# EAGLE design TestJig (EAGLE 6.6.0)
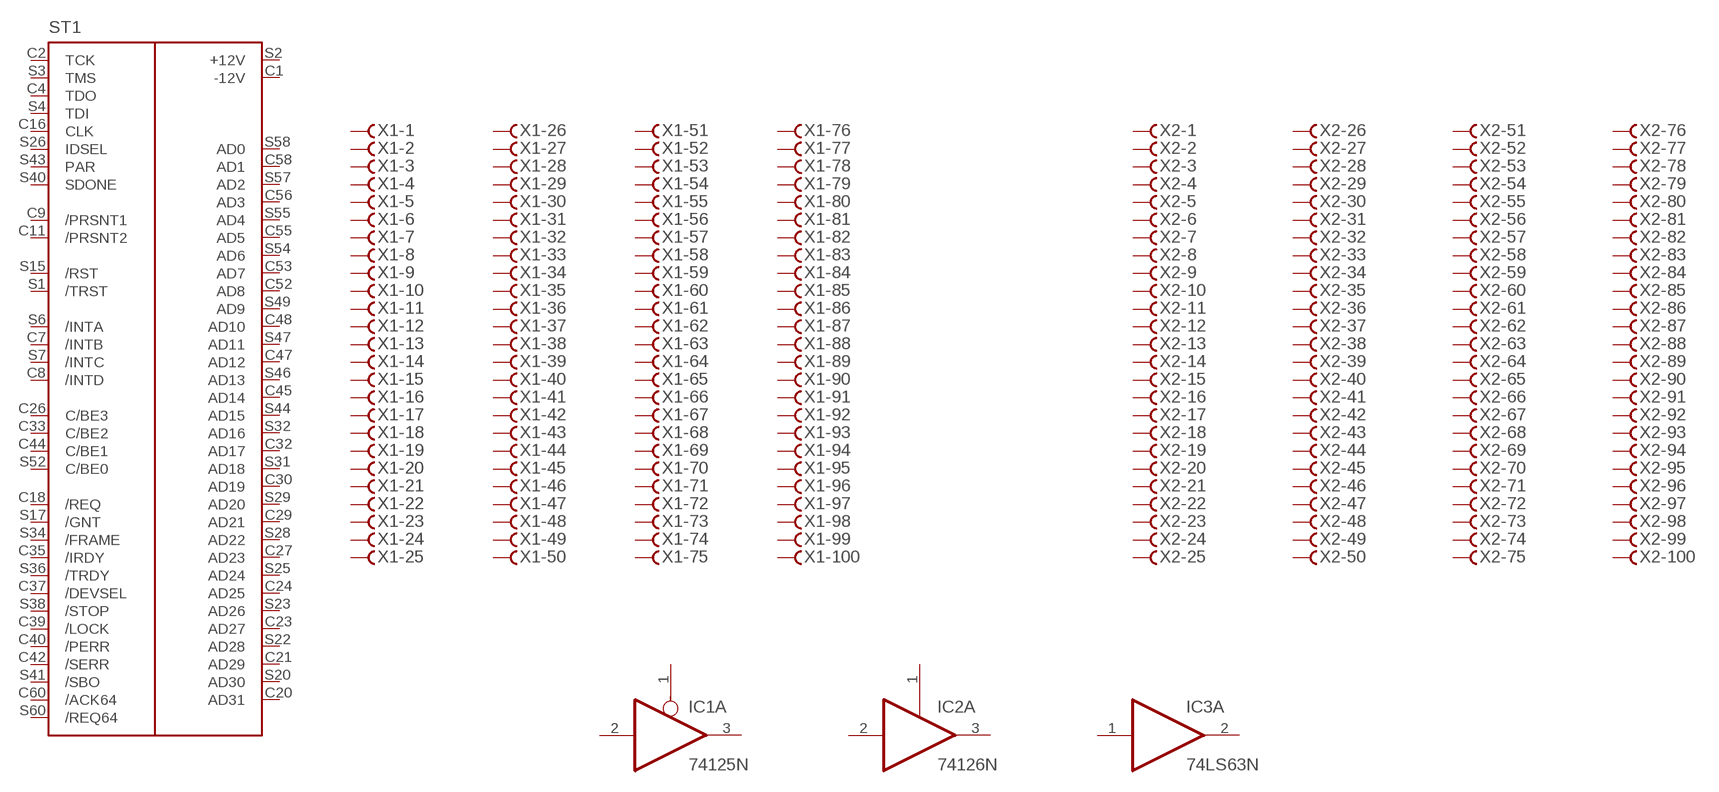
[diagram p0: schematic, sheet 1]

## Parts
IC1  74125N  [DIL14]
IC2  74126N  [DIL14]
IC3  74LS63N  [DIL14]
ST1  PCI2-SLOT  [PCI_BRD]
X1  HFR100RA  [HFR100RA]
X2  HXR100ST  [HXR100ST]
Unconnected: IC1.1(A:OE) IC1.2(A:I) IC1.3(A:O) IC1.4(B:OE) IC1.5(B:I) IC1.6(B:O) IC1.8(C:O) IC1.9(C:I) IC1.10(C:OE) IC1.11(D:O) IC1.12(D:I) IC1.13(D:OE) IC2.1(A:OE) IC2.2(A:I) IC2.3(A:O) IC2.4(B:OE) IC2.5(B:I) IC2.6(B:O) IC2.8(C:O) IC2.9(C:I) IC2.10(C:OE) IC2.11(D:O) IC2.12(D:I) IC2.13(D:OE) IC3.1(A:I) IC3.2(A:O) IC3.3(B:O) IC3.4(B:I) IC3.5(C:I) IC3.6(C:O) IC3.8(D:O) IC3.9(D:I) IC3.10(E:I) IC3.11(E:O) IC3.12(F:O) IC3.13(F:I) ST1.C2(TCK) ST1.C4(TDO) ST1.C7(/INTB) ST1.C8(/INTD) ST1.C9(/PRSNT1) ST1.C10(NC3) ST1.C11(/PRSNT2) ST1.C14(NC4) ST1.C16(CLK) ST1.C18(/REQ) ST1.C20(AD31) ST1.C21(AD29) ST1.C23(AD27) ST1.C24(AD25) ST1.C26(C/BE3) ST1.C27(AD23) ST1.C29(AD21) ST1.C30(AD19) ST1.C32(AD17) ST1.C33(C/BE2) ST1.C35(/IRDY) ST1.C37(/DEVSEL) ST1.C39(/LOCK) ST1.C40(/PERR) ST1.C42(/SERR) ST1.C44(C/BE1) ST1.C45(AD14) ST1.C47(AD12) ST1.C48(AD10) ST1.C52(AD8) ST1.C53(AD7) ST1.C55(AD5) ST1.C56(AD3) ST1.C58(AD1) ST1.C60(/ACK64) ST1.S1(/TRST) ST1.S3(TMS) ST1.S4(TDI) ST1.S6(/INTA) ST1.S7(/INTC) ST1.S9(NC0) ST1.S11(NC5) ST1.S14(NC1) ST1.S15(/RST) ST1.S17(/GNT) ST1.S19(NC2) ST1.S20(AD30) ST1.S22(AD28) ST1.S23(AD26) ST1.S25(AD24) ST1.S26(IDSEL) ST1.S28(AD22) ST1.S29(AD20) ST1.S31(AD18) ST1.S32(AD16) ST1.S34(/FRAME) ST1.S35(GND) ST1.S36(/TRDY) ST1.S38(/STOP) ST1.S39(+3,3V) ST1.S40(SDONE) ST1.S41(/SBO) ST1.S43(PAR) ST1.S44(AD15) ST1.S46(AD13) ST1.S47(AD11) ST1.S49(AD9) ST1.S52(C/BE0) ST1.S54(AD6) ST1.S55(AD4) ST1.S57(AD2) ST1.S58(AD0) ST1.S60(/REQ64) X1.1 X1.2 X1.3 X1.4 X1.5 X1.6 X1.7 X1.8 X1.9 X1.10 X1.11 X1.12 X1.13 X1.14 X1.15 X1.16 X1.17 X1.18 X1.19 X1.20 X1.21 X1.22 X1.23 X1.24 X1.25 X1.26 X1.27 X1.28 X1.29 X1.30 X1.31 X1.32 X1.33 X1.34 X1.35 X1.36 X1.37 X1.38 X1.39 X1.40 X1.41 X1.42 X1.43 X1.44 X1.45 X1.46 X1.47 X1.48 X1.49 X1.50 X1.51 X1.52 X1.53 X1.54 X1.55 X1.56 X1.57 X1.58 X1.59 X1.60 X1.61 X1.62 X1.63 X1.64 X1.65 X1.66 X1.67 X1.68 X1.69 X1.70 X1.71 X1.72 X1.73 X1.74 X1.75 X1.76 X1.77 X1.78 X1.79 X1.80 X1.81 X1.82 X1.83 X1.84 X1.85 X1.86 X1.87 X1.88 X1.89 X1.90 X1.91 X1.92 X1.93 X1.94 X1.95 X1.96 X1.97 X1.98 X1.99 X1.100 X2.1 X2.2 X2.3 X2.4 X2.5 X2.6 X2.7 X2.8 X2.9 X2.10 X2.11 X2.12 X2.13 X2.14 X2.15 X2.16 X2.17 X2.18 X2.19 X2.20 X2.21 X2.22 X2.23 X2.24 X2.25 X2.26 X2.27 X2.28 X2.29 X2.30 X2.31 X2.32 X2.33 X2.34 X2.35 X2.36 X2.37 X2.38 X2.39 X2.40 X2.41 X2.42 X2.43 X2.44 X2.45 X2.46 X2.47 X2.48 X2.49 X2.50 X2.51 X2.52 X2.53 X2.54 X2.55 X2.56 X2.57 X2.58 X2.59 X2.60 X2.61 X2.62 X2.63 X2.64 X2.65 X2.66 X2.67 X2.68 X2.69 X2.70 X2.71 X2.72 X2.73 X2.74 X2.75 X2.76 X2.77 X2.78 X2.79 X2.80 X2.81 X2.82 X2.83 X2.84 X2.85 X2.86 X2.87 X2.88 X2.89 X2.90 X2.91 X2.92 X2.93 X2.94 X2.95 X2.96 X2.97 X2.98 X2.99 X2.100

## Power pins joined to a net without a drawn wire
+3,3V: ST1.C25(+3,3V) ST1.C31(+3,3V) ST1.C36(+3,3V) ST1.C41(+3,3V) ST1.C43(+3,3V) ST1.C54(+3,3V) ST1.S21(+3,3V) ST1.S27(+3,3V) ST1.S33(+3,3V) ST1.S45(+3,3V) ST1.S53(+3,3V)
+5V: ST1.C5(+5V) ST1.C6(+5V) ST1.C19(+5V) ST1.C59(+5V) ST1.C61(+5V) ST1.C62(+5V) ST1.S5(+5V) ST1.S8(+5V) ST1.S10(+5V) ST1.S16(+5V) ST1.S59(+5V) ST1.S61(+5V) ST1.S62(+5V)
+12V: ST1.S2(+12V)
-12V: ST1.C1(-12V)
GND: IC1.7(P:GND) IC2.7(P:GND) IC3.7(P:GND) ST1.C3(GND) ST1.C12(GND) ST1.C13(GND) ST1.C15(GND) ST1.C17(GND) ST1.C22(GND) ST1.C28(GND) ST1.C34(GND) ST1.C38(GND) ST1.C46(GND) ST1.C49(GND) ST1.C57(GND) ST1.S12(GND) ST1.S13(GND) ST1.S18(GND) ST1.S24(GND) ST1.S30(GND) ST1.S37(GND) ST1.S42(GND) ST1.S48(GND) ST1.S56(GND)
VCC: IC1.14(P:VCC) IC2.14(P:VCC) IC3.14(P:VCC)

## Library data of the parts
IC1 = 74xx-us:74*125: Quad bus BUFFER, 3-state
IC2 = 74xx-us:74*126: Quad bus BUFFER, 3-state
IC3 = 74xx-us:74*63: Hex current sensing INTERFACE gate, totem pole
ST1 = con-pc:PCI2-SLOT: PCI BOARD SHORT
X1 = con-thomas-betts:HFR100RA: THOMAS&BETTS; MPN: HFR100RA29CX1; OC_FARNELL: unknown; OC_NEWARK: 92F1766
X2 = con-thomas-betts:HXR100ST: THOMAS&BETTS; OC_FARNELL: unknown; OC_NEWARK: unknown

## Board
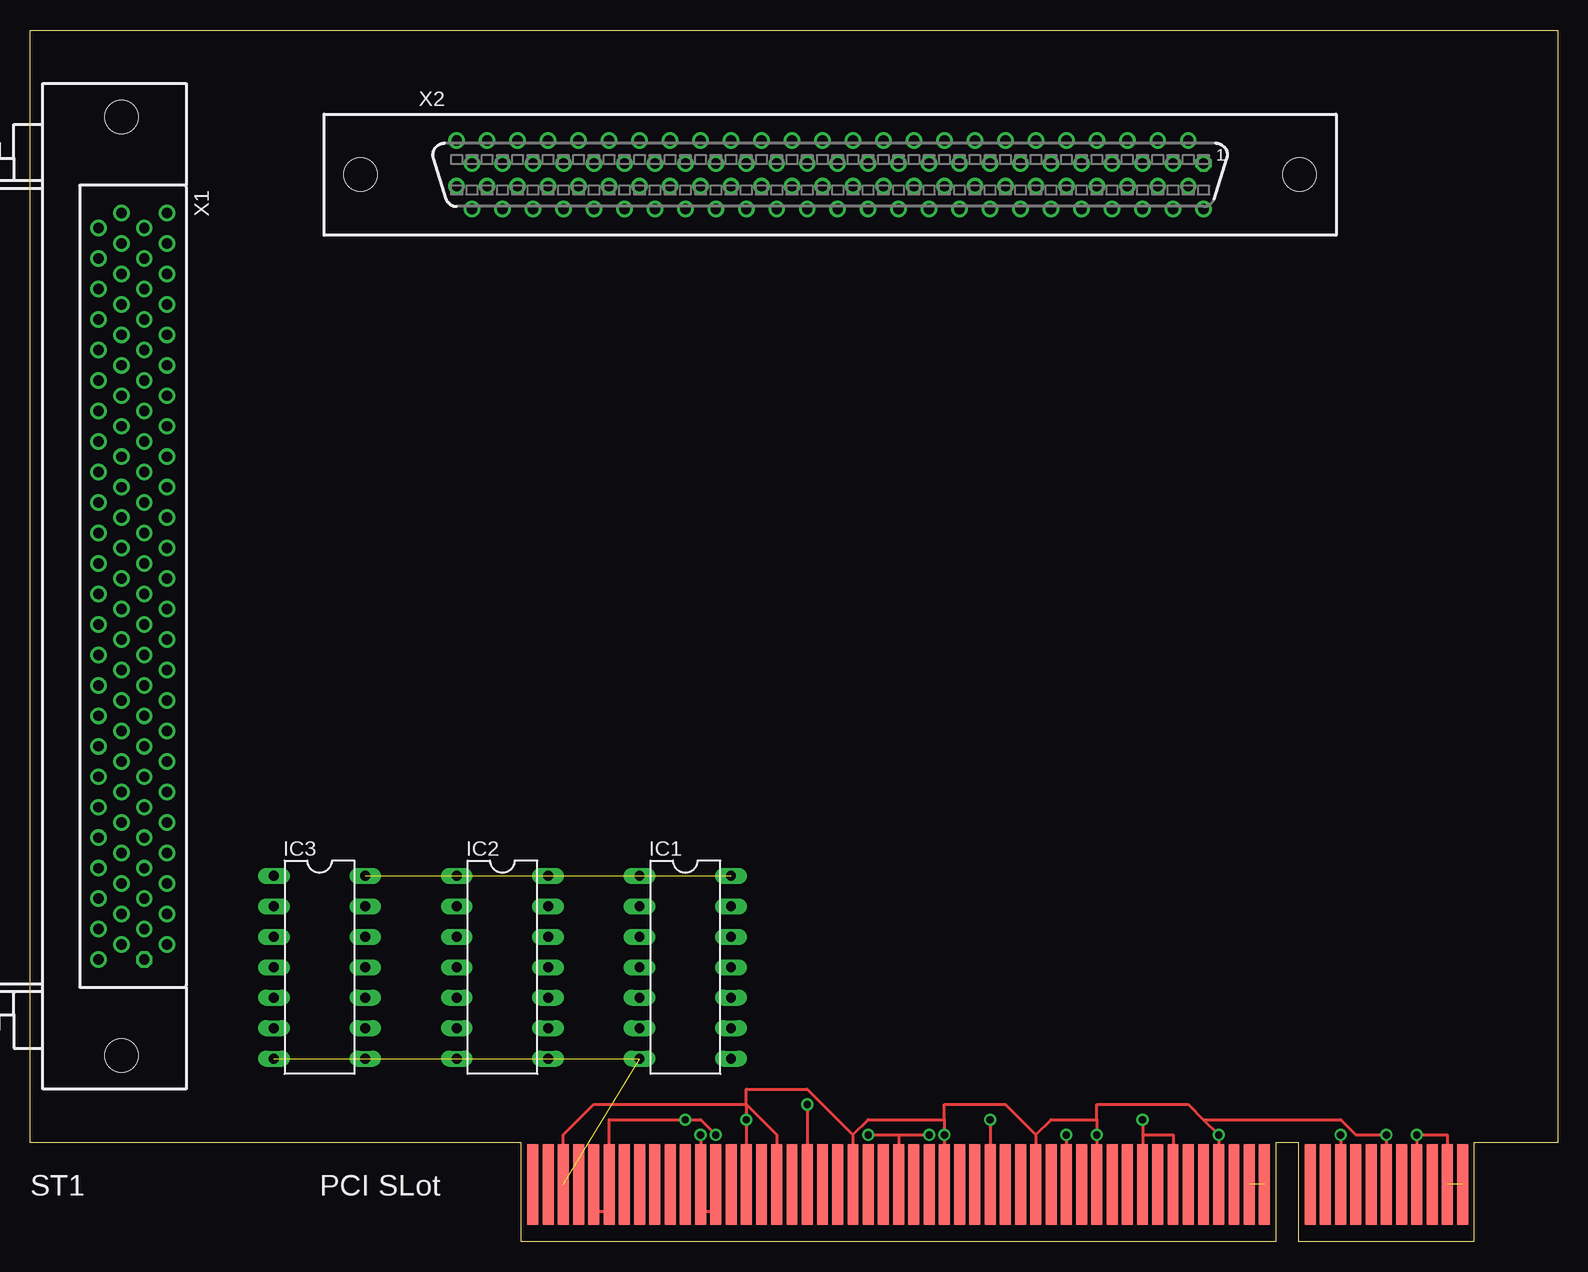
[diagram p1: board, top side]
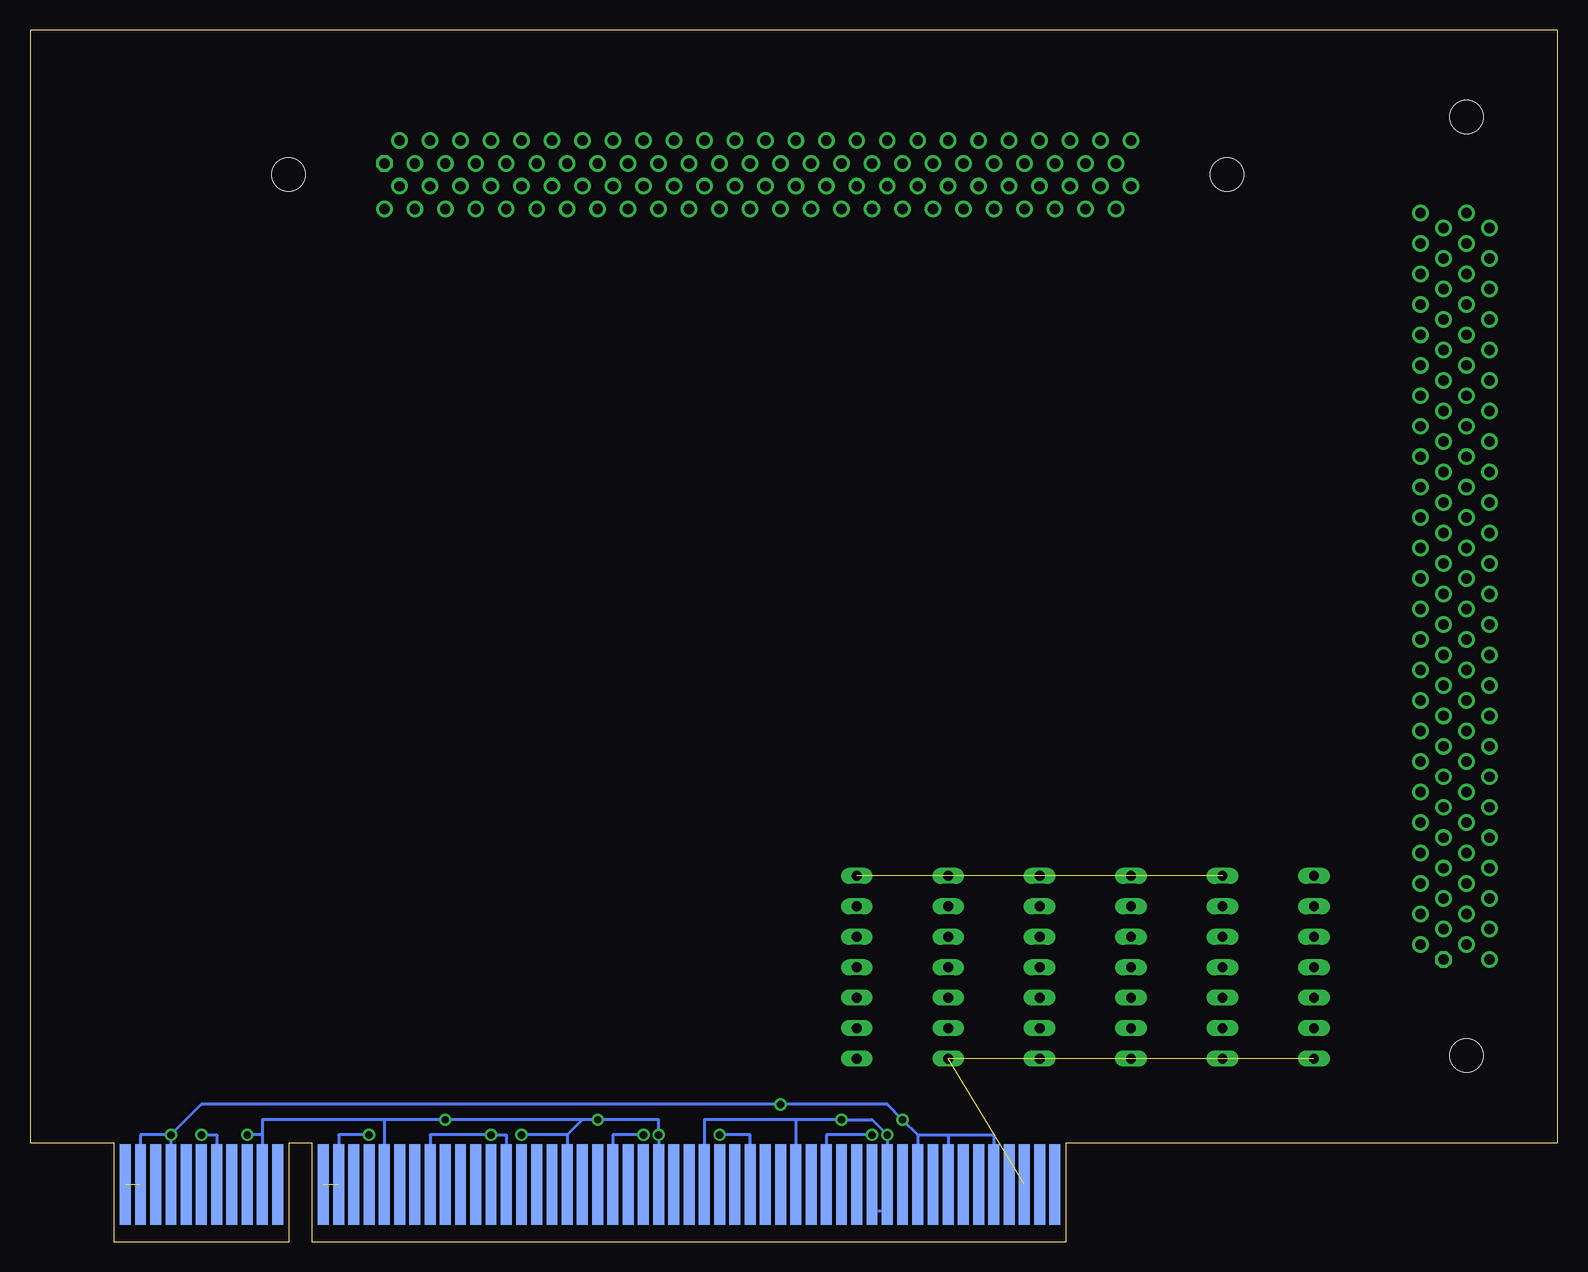
[diagram p2: board, bottom side, seen from below]

Size 127.32 x 100.97 mm. Coordinates in mm from the lower left corner, seen from the top.
Copper layers (1*16): Top 0.035mm / dielectric 1.5mm / Bottom 0.035mm
Design rules "10mils *": minimum track width 10mil, minimum drill 24mil, track to track 10mil, track to pad 10mil, pad to pad 10mil, via to via 10mil, smd to smd 10mil, copper to edge 15mil, drill to drill 10mil, minimum pad ring 10mil, minimum via ring 8mil, stop-mask expansion 0mil, vias tented up to drill 0mil, thermal gap 10mil

### Footprints (pad centres in the part's own frame; a part is rotated, then mirrored left to right if it is on the bottom)
DIL14 = drill 0.813 long: 1 -7.62,-3.81; 2 -5.08,-3.81; 3 -2.54,-3.81; 4 0,-3.81; 5 2.54,-3.81; 6 5.08,-3.81; 7 7.62,-3.81; 8 7.62,3.81; 9 5.08,3.81; 10 2.54,3.81; 11 0,3.81; 12 -2.54,3.81; 13 -5.08,3.81; 14 -7.62,3.81
PCI_BRD = smd 0.91 x 6.7: C1 41.91,4.763; C2 43.18,4.763; C3 44.45,4.763; C4 45.72,4.763; C5 46.99,4.763; C6 48.26,4.763; C7 49.53,4.763; C8 50.8,4.763; C9 52.07,4.763; C10 53.34,4.763; C11 54.61,4.763; C12 55.88,4.763; C13 57.15,4.763; C14 58.42,4.763; C15 59.69,4.763; C16 60.96,4.763; C17 62.23,4.763; C18 63.5,4.763; C19 64.77,4.763; C20 66.04,4.763; C21 67.31,4.763; C22 68.58,4.763; C23 69.85,4.763; C24 71.12,4.763; C25 72.39,4.763; C26 73.66,4.763; C27 74.93,4.763; C28 76.2,4.763; C29 77.47,4.763; C30 78.74,4.763; C31 80.01,4.763; C32 81.28,4.763; C33 82.55,4.763; C34 83.82,4.763; C35 85.09,4.763; C36 86.36,4.763; C37 87.63,4.763; C38 88.9,4.763; C39 90.17,4.763; C40 91.44,4.763; C41 92.71,4.763; C42 93.98,4.763; C43 95.25,4.763; C44 96.52,4.763; C45 97.79,4.763; C46 99.06,4.763; C47 100.33,4.763; C48 101.6,4.763; C49 102.87,4.763; C52 106.68,4.763; C53 107.95,4.763; C54 109.22,4.763; C55 110.49,4.763; C56 111.76,4.763; C57 113.03,4.763; C58 114.3,4.763; C59 115.57,4.763; C60 116.84,4.763; C61 118.11,4.763; C62 119.38,4.763 | smd 0.91 x 6.7 bottom: S1 41.91,4.763; S2 43.18,4.763; S3 44.45,4.763; S4 45.72,4.763; S5 46.99,4.763; S6 48.26,4.763; S7 49.53,4.763; S8 50.8,4.763; S9 52.07,4.763; S10 53.34,4.763; S11 54.61,4.763; S12 55.88,4.763; S13 57.15,4.763; S14 58.42,4.763; S15 59.69,4.763; S16 60.96,4.763; S17 62.23,4.763; S18 63.5,4.763; S19 64.77,4.763; S20 66.04,4.763; S21 67.31,4.763; S22 68.58,4.763; S23 69.85,4.763; S24 71.12,4.763; S25 72.39,4.763; S26 73.66,4.763; S27 74.93,4.763; S28 76.2,4.763; S29 77.47,4.763; S30 78.74,4.763; S31 80.01,4.763; S32 81.28,4.763; S33 82.55,4.763; S34 83.82,4.763; S35 85.09,4.763; S36 86.36,4.763; S37 87.63,4.763; S38 88.9,4.763; S39 90.17,4.763; S40 91.44,4.763; S41 92.71,4.763; S42 93.98,4.763; S43 95.25,4.763; S44 96.52,4.763; S45 97.79,4.763; S46 99.06,4.763; S47 100.33,4.763; S48 101.6,4.763; S49 102.87,4.763; S52 106.68,4.763; S53 107.95,4.763; S54 109.22,4.763; S55 110.49,4.763; S56 111.76,4.763; S57 113.03,4.763; S58 114.3,4.763; S59 115.57,4.763; S60 116.84,4.763; S61 118.11,4.763; S62 119.38,4.763
HFR100RA = drill 0.864 octagon: 1 31.115,6.98 | drill 0.864: 2 29.845,8.89; 3 28.575,6.98; 4 27.305,8.89; 5 26.035,6.98; 6 24.765,8.89; 7 23.495,6.98; 8 22.225,8.89; 9 20.955,6.98; 10 19.685,8.89; 11 18.415,6.98; 12 17.145,8.89; 13 15.875,6.98; 14 14.605,8.89; 15 13.335,6.98; 16 12.065,8.89; 17 10.795,6.98; 18 9.525,8.89; 19 8.255,6.98; 20 6.985,8.89; 21 5.715,6.98; 22 4.445,8.89; 23 3.175,6.98; 24 1.905,8.89; 25 0.635,6.98; 26 -0.635,8.89; 27 -1.905,6.98; 28 -3.175,8.89; 29 -4.445,6.98; 30 -5.715,8.89; 31 -6.985,6.98; 32 -8.255,8.89; 33 -9.525,6.98; 34 -10.795,8.89; 35 -12.065,6.98; 36 -13.335,8.89; 37 -14.605,6.98; 38 -15.875,8.89; 39 -17.145,6.98; 40 -18.415,8.89; 41 -19.685,6.98; 42 -20.955,8.89; 43 -22.225,6.98; 44 -23.495,8.89; 45 -24.765,6.98; 46 -26.035,8.89; 47 -27.305,6.98; 48 -28.575,8.89; 49 -29.845,6.98; 50 -31.115,8.89; 51 31.115,3.16; 52 29.845,5.07; 53 28.575,3.16; 54 27.305,5.07; 55 26.035,3.16; 56 24.765,5.07; 57 23.495,3.16; 58 22.225,5.07; 59 20.955,3.16; 60 19.685,5.07; 61 18.415,3.16; 62 17.145,5.07; 63 15.875,3.16; 64 14.605,5.07; 65 13.335,3.16; 66 12.065,5.07; 67 10.795,3.16; 68 9.525,5.07; 69 8.255,3.16; 70 6.985,5.07; 71 5.715,3.16; 72 4.445,5.07; 73 3.175,3.16; 74 1.905,5.07; 75 0.635,3.16; 76 -0.635,5.07; 77 -1.905,3.16; 78 -3.175,5.07; 79 -4.445,3.16; 80 -5.715,5.07; 81 -6.985,3.16; 82 -8.255,5.07; 83 -9.525,3.16; 84 -10.795,5.07; 85 -12.065,3.16; 86 -13.335,5.07; 87 -14.605,3.16; 88 -15.875,5.07; 89 -17.145,3.16; 90 -18.415,5.07; 91 -19.685,3.16; 92 -20.955,5.07; 93 -22.225,3.16; 94 -23.495,5.07; 95 -24.765,3.16; 96 -26.035,5.07; 97 -27.305,3.16; 98 -28.575,5.07; 99 -29.845,3.16; 100 -31.115,5.07 | hole 2.769: 39.116,5.07; -39.116,5.07
HXR100ST = drill 0.864 octagon: 1 31.115,0.953 | drill 0.864: 2 29.845,2.857; 3 28.575,0.953; 4 27.305,2.857; 5 26.035,0.953; 6 24.765,2.857; 7 23.495,0.953; 8 22.225,2.857; 9 20.955,0.953; 10 19.685,2.857; 11 18.415,0.953; 12 17.145,2.857; 13 15.875,0.953; 14 14.605,2.857; 15 13.335,0.953; 16 12.065,2.857; 17 10.795,0.953; 18 9.525,2.857; 19 8.255,0.953; 20 6.985,2.857; 21 5.715,0.953; 22 4.445,2.857; 23 3.175,0.953; 24 1.905,2.857; 25 0.635,0.953; 26 -0.635,2.857; 27 -1.905,0.953; 28 -3.175,2.857; 29 -4.445,0.953; 30 -5.715,2.857; 31 -6.985,0.953; 32 -8.255,2.857; 33 -9.525,0.953; 34 -10.795,2.857; 35 -12.065,0.953; 36 -13.335,2.857; 37 -14.605,0.953; 38 -15.875,2.857; 39 -17.145,0.953; 40 -18.415,2.857; 41 -19.685,0.953; 42 -20.955,2.857; 43 -22.225,0.953; 44 -23.495,2.857; 45 -24.765,0.953; 46 -26.035,2.857; 47 -27.305,0.953; 48 -28.575,2.857; 49 -29.845,0.953; 50 -31.115,2.857; 51 31.115,-2.857; 52 29.845,-0.953; 53 28.575,-2.857; 54 27.305,-0.953; 55 26.035,-2.857; 56 24.765,-0.953; 57 23.495,-2.857; 58 22.225,-0.953; 59 20.955,-2.857; 60 19.685,-0.953; 61 18.415,-2.857; 62 17.145,-0.953; 63 15.875,-2.857; 64 14.605,-0.953; 65 13.335,-2.857; 66 12.065,-0.953; 67 10.795,-2.857; 68 9.525,-0.953; 69 8.255,-2.857; 70 6.985,-0.953; 71 5.715,-2.857; 72 4.445,-0.953; 73 3.175,-2.857; 74 1.905,-0.953; 75 0.635,-2.857; 76 -0.635,-0.953; 77 -1.905,-2.857; 78 -3.175,-0.953; 79 -4.445,-2.857; 80 -5.715,-0.953; 81 -6.985,-2.857; 82 -8.255,-0.953; 83 -9.525,-2.857; 84 -10.795,-0.953; 85 -12.065,-2.857; 86 -13.335,-0.953; 87 -14.605,-2.857; 88 -15.875,-0.953; 89 -17.145,-2.857; 90 -18.415,-0.953; 91 -19.685,-2.857; 92 -20.955,-0.953; 93 -22.225,-2.857; 94 -23.495,-0.953; 95 -24.765,-2.857; 96 -26.035,-0.953; 97 -27.305,-2.857; 98 -28.575,-0.953; 99 -29.845,-2.857; 100 -31.115,-0.953 | hole 2.769: 39.116,0.013; -39.116,0.013

### Placement (x,y rotation side)
IC1  54.61,22.86 270 top
IC2  39.37,22.86 270 top
IC3  24.13,22.86 270 top
ST1  0,0 0 top
X1  2.54,54.61 270 top
X2  66.67,88.9 0 top

### Tracks (layer width: path | path; a pad name or v marks a point on that pad's centre or on a via)
+3,3V  (via drill 0.61)
  Top 0.254: v69.85,8.89 72.39,8.89 | 72.39,8.89 72.39,7.62 ST1.C25 | 92.71,8.89 92.71,7.62 ST1.C41 | 92.71,8.89 95.25,8.89 95.25,7.62 ST1.C43 | v80.01,10.16 80.01,7.62 ST1.C31 | v86.36,8.89 86.36,7.62 ST1.C36 | v109.22,8.89 109.22,7.62 ST1.C54 | v92.71,10.16 92.71,8.89 | 72.39,8.89 v74.93,8.89
  Bottom 0.254: v69.85,8.89 67.31,8.89 67.31,7.62 ST1.S21 | 81.28,10.16 v80.01,10.16 74.93,10.16 v74.93,8.89 74.93,7.62 ST1.S27 | 81.28,10.16 82.55,8.89 | 82.55,8.89 82.55,7.62 ST1.S33 | 82.55,8.89 v86.36,8.89 | 97.79,10.16 97.79,7.62 ST1.S45 | 81.28,10.16 v92.71,10.16 97.79,10.16 | 107.95,8.89 107.95,10.16 97.79,10.16 | 107.95,8.89 107.95,7.62 ST1.S53 | 107.95,8.89 v109.22,8.89
+5V  (via drill 0.61)  (2 unrouted)
  Top 0.254: ST1.C5 46.99,2.54 48.26,2.54 ST1.C6 48.26,7.62 48.26,10.16 v54.61,10.16 55.88,10.16 v57.15,8.89 | ST1.C59 115.57,7.62 v115.57,8.89 118.11,8.89 118.11,7.62 ST1.C61 | v64.77,11.43 64.77,7.62 ST1.C19
  Bottom 0.254: v57.15,8.89 60.96,8.89 60.96,7.62 ST1.S16 | v115.57,8.89 115.57,7.62 ST1.C59 | v115.57,8.89 118.11,8.89 118.11,7.62 ST1.C61 | 50.8,8.89 46.99,8.89 46.99,7.62 ST1.C5 | 50.8,8.89 50.8,7.62 ST1.S8 | 53.34,8.89 53.34,7.62 ST1.S10 | 53.34,8.89 50.8,8.89 | 53.34,8.89 v54.61,10.16 55.88,11.43 v64.77,11.43 113.03,11.43 v115.57,8.89
GND  (via drill 0.61)  (4 unrouted)
  Top 0.254: ST1.C57 113.03,7.62 v113.03,8.89 110.49,8.89 109.22,10.16 97.79,10.16 | 83.82,8.89 83.82,7.62 ST1.C34 | 83.82,8.89 85.09,10.16 88.9,10.16 | 88.9,10.16 v88.9,8.89 88.9,7.62 ST1.C38 | 97.79,10.16 96.52,11.43 88.9,11.43 88.9,10.16 | 97.79,10.16 v99.06,8.89 99.06,7.62 ST1.C46 | ST1.C13 57.15,2.54 55.88,2.54 ST1.C12 55.88,7.62 v55.88,8.89 | 68.58,8.89 68.58,7.62 ST1.C22 | 68.58,8.89 69.85,10.16 76.2,10.16 | 76.2,10.16 v76.2,8.89 76.2,7.62 ST1.C28 | 59.69,11.43 46.99,11.43 44.45,8.89 44.45,7.62 ST1.C3 | 59.69,11.43 v59.69,10.16 59.69,7.62 ST1.C15 | 59.69,11.43 62.23,8.89 62.23,7.62 ST1.C17 | 68.58,8.89 64.77,12.7 59.69,12.7 59.69,11.43 | 83.82,8.89 81.28,11.43 76.2,11.43 76.2,10.16
  Bottom 0.254: ST1.S37 87.63,7.62 87.63,8.89 v88.9,8.89 93.98,8.89 93.98,7.62 ST1.S42 | v113.03,8.89 111.76,8.89 111.76,7.62 ST1.S56 | v99.06,8.89 101.6,8.89 101.6,7.62 ST1.S48 | ST1.C13 57.15,2.54 55.88,2.54 ST1.C12 55.88,7.62 v55.88,8.89 57.15,10.16 v59.69,10.16 63.5,10.16 | 63.5,10.16 63.5,7.62 ST1.S18 | 63.5,10.16 71.12,10.16 71.12,7.62 ST1.S24 | v76.2,8.89 78.74,8.89 78.74,7.62 ST1.S30
VCC  (2 unrouted)